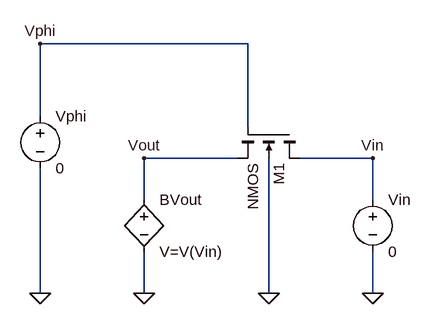
[diagram p0: schematic Chapter03A_07.fig.asc]
Chapter03A_07.fig.asc, the LTspice schematic file:
Version 4
SHEET 1 2940 740
WIRE 384 112 64 112
WIRE 64 224 64 112
WIRE 384 240 384 112
WIRE 368 288 224 288
WIRE 576 288 464 288
WIRE 224 352 224 288
WIRE 576 352 576 288
WIRE 64 496 64 304
WIRE 224 496 224 432
WIRE 416 496 416 288
WIRE 576 496 576 432
FLAG 64 496 0
FLAG 224 496 0
FLAG 576 496 0
FLAG 416 496 0
FLAG 64 112 Vphi
FLAG 224 288 Vout
FLAG 576 288 Vin
SYMBOL nmos4 464 240 R90
SYMATTR InstName M1
SYMBOL voltage 64 208 R0
WINDOW 123 0 0 Left 0
WINDOW 39 0 0 Left 0
SYMATTR InstName Vphi
SYMATTR Value 0
SYMBOL voltage 576 336 R0
SYMATTR InstName Vin
SYMATTR Value 0
SYMBOL bv 224 336 R0
SYMATTR InstName BVout
SYMATTR Value V=V(Vin)

The netlist it stands for:
* Chapter03A_07.fig.asc
M1 Vin Vphi Vout 0 NMOS
Vphi Vphi 0 0
Vin Vin 0 0
BVout Vout 0 V=V(Vin)
.model NMOS NMOS
.model PMOS PMOS
.lib standard.mos
.backanno
.end